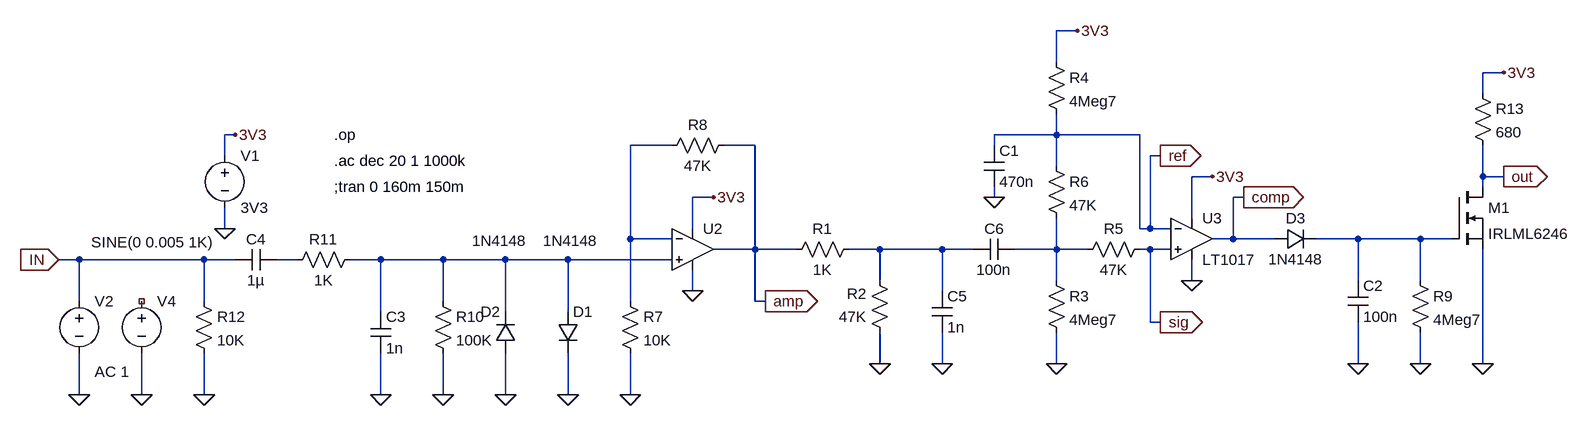
[diagram p0: schematic snd_detect.asc]
snd_detect.asc, the LTspice schematic file:
Version 4
SHEET 1 2344 2032
WIRE -2816 304 -2848 304
WIRE -2848 352 -2848 304
WIRE -2160 368 -2192 368
WIRE -2192 400 -2192 368
WIRE -4112 464 -4128 464
WIRE -2848 464 -2848 432
WIRE -2848 464 -2944 464
WIRE -2720 464 -2848 464
WIRE -3440 480 -3504 480
WIRE -3312 480 -3360 480
WIRE -2944 480 -2944 464
WIRE -4128 496 -4128 464
WIRE -2688 496 -2704 496
WIRE -2848 512 -2848 464
WIRE -2608 528 -2640 528
WIRE -2192 528 -2192 480
WIRE -2160 528 -2192 528
WIRE -2192 544 -2192 528
WIRE -3376 560 -3408 560
WIRE -2944 560 -2944 544
WIRE -2560 560 -2576 560
WIRE -2640 592 -2640 528
WIRE -4128 608 -4128 576
WIRE -3408 608 -3408 560
WIRE -2720 608 -2720 464
WIRE -2704 608 -2704 496
WIRE -2704 608 -2720 608
WIRE -2672 608 -2704 608
WIRE -3504 624 -3504 480
WIRE -3440 624 -3504 624
WIRE -2576 624 -2576 560
WIRE -2576 624 -2608 624
WIRE -2512 624 -2576 624
WIRE -2384 624 -2448 624
WIRE -2288 624 -2384 624
WIRE -2240 624 -2288 624
WIRE -3312 640 -3312 480
WIRE -3312 640 -3376 640
WIRE -3248 640 -3312 640
WIRE -3120 640 -3168 640
WIRE -3024 640 -3120 640
WIRE -2976 640 -3024 640
WIRE -2848 640 -2848 592
WIRE -2848 640 -2912 640
WIRE -2800 640 -2848 640
WIRE -2704 640 -2720 640
WIRE -2672 640 -2704 640
WIRE -4352 656 -4384 656
WIRE -4160 656 -4352 656
WIRE -4112 656 -4160 656
WIRE -4016 656 -4048 656
WIRE -3888 656 -3936 656
WIRE -3792 656 -3888 656
WIRE -3696 656 -3792 656
WIRE -3600 656 -3696 656
WIRE -3440 656 -3600 656
WIRE -3120 688 -3120 640
WIRE -2848 688 -2848 640
WIRE -2640 688 -2640 656
WIRE -2384 688 -2384 624
WIRE -2288 688 -2288 624
WIRE -3408 704 -3408 672
WIRE -3024 704 -3024 640
WIRE -4352 720 -4352 656
WIRE -4160 720 -4160 656
WIRE -3792 720 -3792 656
WIRE -3504 720 -3504 624
WIRE -3312 720 -3312 640
WIRE -3296 720 -3312 720
WIRE -3888 736 -3888 656
WIRE -3696 736 -3696 656
WIRE -3600 736 -3600 656
WIRE -2704 752 -2704 640
WIRE -2688 752 -2704 752
WIRE -3120 816 -3120 768
WIRE -3024 816 -3024 768
WIRE -2848 816 -2848 768
WIRE -2384 816 -2384 752
WIRE -2288 816 -2288 768
WIRE -2192 816 -2192 640
WIRE -4352 864 -4352 800
WIRE -4256 864 -4256 800
WIRE -4160 864 -4160 800
WIRE -3888 864 -3888 800
WIRE -3792 864 -3792 800
WIRE -3696 864 -3696 800
WIRE -3600 864 -3600 800
WIRE -3504 864 -3504 800
FLAG -4128 608 0
FLAG -4256 864 0
FLAG -3504 864 0
FLAG -3792 864 0
FLAG -3888 864 0
FLAG -4160 864 0
FLAG -3408 704 0
FLAG -3376 560 3V3
FLAG -3696 864 0
FLAG -4352 864 0
FLAG -3600 864 0
FLAG -3120 816 0
FLAG -2640 688 0
FLAG -2608 528 3V3
FLAG -2848 816 0
FLAG -2944 560 0
FLAG -2816 304 3V3
FLAG -2384 816 0
FLAG -2288 816 0
FLAG -4384 656 IN
IOPIN -4384 656 In
FLAG -2192 816 0
FLAG -2160 368 3V3
FLAG -4112 464 3V3
FLAG -2560 560 comp
IOPIN -2560 560 Out
FLAG -2688 496 ref
IOPIN -2688 496 Out
FLAG -2688 752 sig
IOPIN -2688 752 Out
FLAG -3296 720 amp
IOPIN -3296 720 Out
FLAG -2160 528 out
IOPIN -2160 528 Out
FLAG -3024 816 0
SYMBOL VOLTAGE -4128 480 R0
WINDOW 123 0 0 Left 2
WINDOW 39 0 0 Left 2
SYMATTR InstName V1
SYMATTR Value 3V3
SYMBOL voltage -4256 704 R0
WINDOW 123 0 0 Left 2
WINDOW 39 0 0 Left 2
WINDOW 3 -78 -75 Left 2
SYMATTR Value SINE(0 0.005 1K)
SYMATTR InstName V4
SYMBOL res -3520 704 R0
SYMATTR InstName R7
SYMATTR Value 10K
SYMBOL res -3808 704 R0
SYMATTR InstName R10
SYMATTR Value 100K
SYMBOL res -3920 640 R90
WINDOW 0 0 56 VBottom 2
WINDOW 3 32 56 VTop 2
SYMATTR InstName R11
SYMATTR Value 1K
SYMBOL cap -3904 736 R0
SYMATTR InstName C3
SYMATTR Value 1n
SYMBOL cap -4048 640 R90
WINDOW 0 0 32 VBottom 2
WINDOW 3 32 32 VTop 2
SYMATTR InstName C4
SYMATTR Value 1µ
SYMBOL res -4176 704 R0
SYMATTR InstName R12
SYMATTR Value 10K
SYMBOL Opamps\\UniversalOpamp2 -3408 640 R0
SYMATTR InstName U2
SYMBOL res -3344 464 R90
WINDOW 0 0 56 VBottom 2
WINDOW 3 32 56 VTop 2
SYMATTR InstName R8
SYMATTR Value 47K
SYMBOL voltage -4352 704 R0
WINDOW 123 24 124 Left 2
WINDOW 39 0 0 Left 2
SYMATTR Value2 AC 1
SYMATTR InstName V2
SYMATTR Value ""
SYMBOL diode -3616 736 R0
WINDOW 3 -22 -109 Left 2
SYMATTR Value 1N4148
SYMATTR InstName D1
SYMBOL diode -3680 800 R180
WINDOW 0 24 64 Left 2
WINDOW 3 -17 173 Left 2
SYMATTR InstName D2
SYMATTR Value 1N4148
SYMBOL res -3152 624 R90
WINDOW 0 0 56 VBottom 2
WINDOW 3 32 56 VTop 2
SYMATTR InstName R1
SYMATTR Value 1K
SYMBOL res -3104 784 R180
WINDOW 0 36 76 Left 2
WINDOW 3 36 40 Left 2
SYMATTR InstName R2
SYMATTR Value 47K
SYMBOL res -2864 672 R0
SYMATTR InstName R3
SYMATTR Value 4Meg7
SYMBOL res -2864 336 R0
SYMATTR InstName R4
SYMATTR Value 4Meg7
SYMBOL res -2704 624 R90
WINDOW 0 0 56 VBottom 2
WINDOW 3 32 56 VTop 2
SYMATTR InstName R5
SYMATTR Value 47K
SYMBOL res -2864 496 R0
SYMATTR InstName R6
SYMATTR Value 47K
SYMBOL cap -2960 480 R0
SYMATTR InstName C1
SYMATTR Value 470n
SYMBOL diode -2512 640 R270
WINDOW 0 32 32 VTop 2
WINDOW 3 0 32 VBottom 2
SYMATTR InstName D3
SYMATTR Value 1N4148
SYMBOL cap -2400 688 R0
SYMATTR InstName C2
SYMATTR Value 100n
SYMBOL res -2304 672 R0
SYMATTR InstName R9
SYMATTR Value 4Meg7
SYMBOL nmos -2240 544 R0
SYMATTR InstName M1
SYMATTR Value IRLML6246
SYMBOL res -2208 384 R0
SYMATTR InstName R13
SYMATTR Value 680
SYMBOL Comparators\\LT1017 -2640 624 R0
SYMATTR InstName U3
SYMBOL cap -2912 624 R90
WINDOW 0 0 32 VBottom 2
WINDOW 3 32 32 VTop 2
SYMATTR InstName C6
SYMATTR Value 100n
SYMBOL cap -3040 704 R0
SYMATTR InstName C5
SYMATTR Value 1n
TEXT -3960 544 Left 2 !;tran 0 160m 150m
TEXT -3960 504 Left 2 !.ac dec 20 1 1000k
TEXT -3960 464 Left 2 !.op

The netlist it stands for:
* snd_detect.asc
V1 3V3 0 3V3
V4 NC_01 0 SINE(0 0.005 1K)
R7 N001 0 10K
R10 N006 0 100K
R11 N006 N005 1K
C3 N006 0 1n
C4 N005 IN 1µ
R12 IN 0 10K
XU2 N006 N001 3V3 0 amp level.2 Avol=1Meg GBW=10Meg Slew=10Meg ilimit=25m rail=0 Vos=0 phimargin=45 en=0 enk=0 in=0 ink=0 Rin=500Meg  ; pins IN+ IN- V+ V- OUT
R8 amp N001 47K
V2 IN 0 AC 1
D1 N006 0 1N4148
D2 0 N006 1N4148
R1 N003 amp 1K
R2 0 N003 47K
R3 N004 0 4Meg7
R4 3V3 ref 4Meg7
R5 sig N004 47K
R6 ref N004 47K
C1 ref 0 470n
D3 comp N002 1N4148
C2 N002 0 100n
R9 N002 0 4Meg7
M1 out N002 0 0 IRLML6246
R13 3V3 out 680
XU3 sig ref 3V3 0 comp LT1017  ; pins In+ In- V+ V- OUT
C6 N004 N003 100n
C5 N003 0 1n
.model D D
.lib standard.dio
.model NMOS NMOS
.model PMOS PMOS
.lib standard.mos
;tran 0 160m 150m
.ac dec 20 1 1000k
.op
.lib UniversalOpamps2.sub
.backanno
.end